# Altium schematic sheet Power.SchDoc
size A4; SheetNumber: 4; SheetTotal: 4
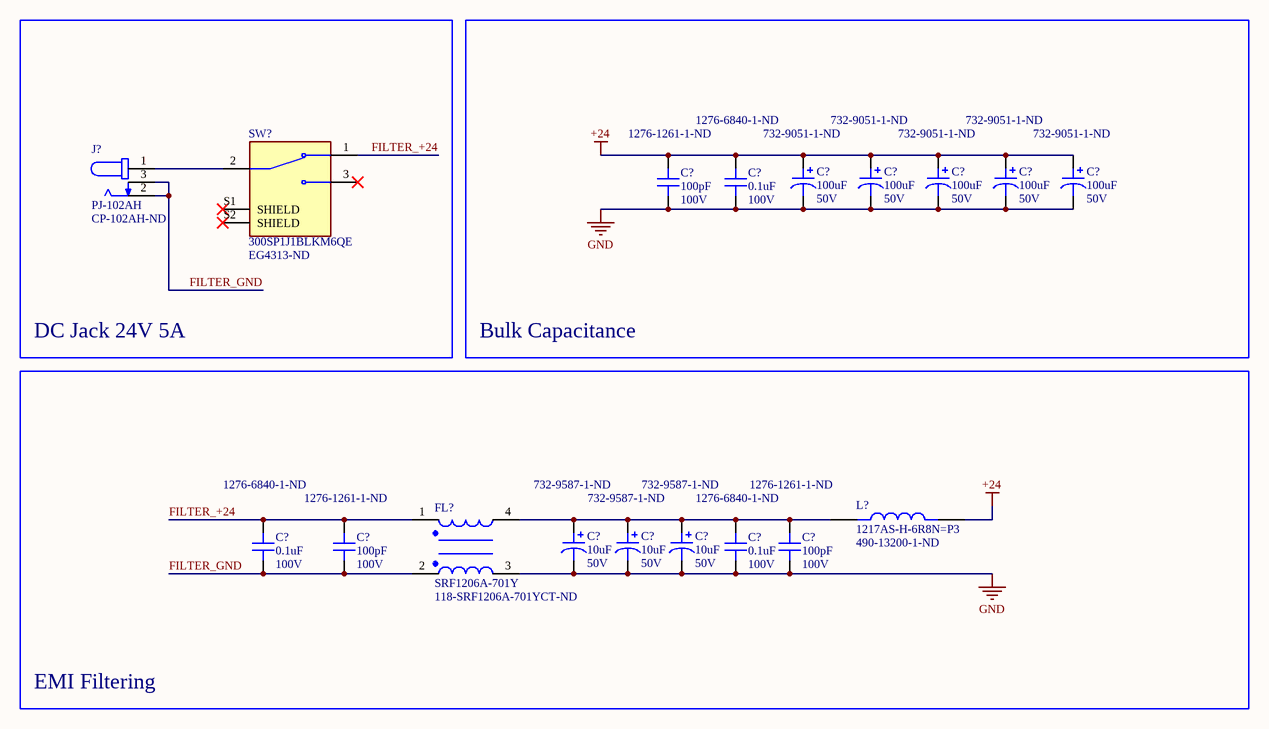
[diagram p0: Power.SchDoc]

## Parts
(Parts that share a designator on the sheet are numbered #1, #2 ... from top to bottom, then left to right.)
C?#1  value 100pF  Voltage: 100V  Supplier Part Number 1: 1276-1261-1-ND  [CAP 0402/1005]  (hidden comment: Capacitor_SMD)
C?#2  value 0.1uF  Voltage: 100V  Supplier Part Number 1: 1276-6840-1-ND  [CAP 0805/2012]  (hidden comment: Capacitor_SMD)
C?#3  value 100uF  Voltage: 50V  Supplier Part Number 1: 732-9051-1-ND  [CAP AL TH D8 L3.5 H21]  (hidden comment: Capacitor_Pol)
C?#4  value 100uF  Voltage: 50V  Supplier Part Number 1: 732-9051-1-ND  [CAP AL TH D8 L3.5 H21]  (hidden comment: Capacitor_Pol)
C?#5  value 100uF  Voltage: 50V  Supplier Part Number 1: 732-9051-1-ND  [CAP AL TH D8 L3.5 H21]  (hidden comment: Capacitor_Pol)
C?#6  value 100uF  Voltage: 50V  Supplier Part Number 1: 732-9051-1-ND  [CAP AL TH D8 L3.5 H21]  (hidden comment: Capacitor_Pol)
C?#7  value 100uF  Voltage: 50V  Supplier Part Number 1: 732-9051-1-ND  [CAP AL TH D8 L3.5 H21]  (hidden comment: Capacitor_Pol)
C?#8  value 0.1uF  Voltage: 100V  Supplier Part Number 1: 1276-6840-1-ND  [CAP 0805/2012]  (hidden comment: Capacitor_SMD)
C?#9  value 100pF  Voltage: 100V  Supplier Part Number 1: 1276-1261-1-ND  [CAP 0402/1005]  (hidden comment: Capacitor_SMD)
C?#10  value 10uF  Voltage: 50V  Supplier Part Number 1: 732-9587-1-ND  [CAP AL TH D5 L2 H12.5]  (hidden comment: Capacitor_Pol)
C?#11  value 10uF  Voltage: 50V  Supplier Part Number 1: 732-9587-1-ND  [CAP AL TH D5 L2 H12.5]  (hidden comment: Capacitor_Pol)
C?#12  value 10uF  Voltage: 50V  Supplier Part Number 1: 732-9587-1-ND  [CAP AL TH D5 L2 H12.5]  (hidden comment: Capacitor_Pol)
C?#13  value 0.1uF  Voltage: 100V  Supplier Part Number 1: 1276-6840-1-ND  [CAP 0805/2012]  (hidden comment: Capacitor_SMD)
C?#14  value 100pF  Voltage: 100V  Supplier Part Number 1: 1276-1261-1-ND  [CAP 0402/1005]  (hidden comment: Capacitor_SMD)
FL?  SRF1206A-701Y  Supplier Part Number 1: 118-SRF1206A-701YCT-ND
J?  PJ-102AH  Supplier Part Number 1: CP-102AH-ND  [CUI_PJ-102AH]
L?  1217AS-H-6R8N=P3  Supplier Part Number 1: 490-13200-1-ND  [IND_1217AS-H-6R8N=P3]
SW?  300SP1J1BLKM6QE  Supplier Part Number 1: EG4313-ND  [SW_300SP1J1BLKM6QE]

## Blocks framed on the sheet
DC Jack 24V 5A: J? SW?
Bulk Capacitance: C?#1-C?#7
EMI Filtering: C?#8-C?#14 FL? L?

## Nets
+24: C?#1.1 C?#2.1 C?#3.1 C?#4.1 C?#5.1 C?#6.1 C?#7.1 L?.2
GND: C?#1.2 C?#2.2 C?#3.2 C?#4.2 C?#5.2 C?#6.2 C?#7.2 C?#10.2 C?#11.2 C?#12.2 C?#13.2 C?#14.2 FL?.3
FILTER_+24: C?#8.1 C?#9.1 FL?.1 SW?.1
FILTER_GND: C?#8.2 C?#9.2 FL?.2 J?.2 J?.3
NetC?#10_1: C?#10.1 C?#11.1 C?#12.1 C?#13.1 C?#14.1 FL?.4 L?.1
NetJ?_1: J?.1 SW?.2

Not connected (* = marked no-connect by the designer): SW? 3* S1(SHIELD)* S2(SHIELD)*

## Library data of the parts
C?#1 C?#2 C?#8 C?#9 C?#13 C?#14 = Capacitor_SMD: SMD Capacitor; Supplier 1: Digi-Key
C?#3-C?#7 C?#10-C?#12 = Capacitor_Pol: THT Polarised Capacitor; Supplier 1: Digi-Key
FL? = SRF1206A-701Y: Common Mode Choke 80VDC 8A; Value: 9uH; Supplier 1: Digi-Key
J? = PJ-102AH: 2.0 x 6.5 mm, 5.0 A, Horizontal, Through Hole, Tapered Pins, Dc Power Jack Connector; MF: CUI Devices; Digi-Key_Part_Number: CP-102AH-ND; CUI_purchase_URL: https://www.cuidevices.com/product/interconnect/connectors/dc-power-connectors/jacks/pj-102ah?utm_source=snapeda.com&utm_medium=referral&utm_campaign=snapedaBOM; SnapEDA_Link: https://www.snapeda.com/parts/PJ-102AH/CUI%20Devices/view-part/228264/?ref=snap; Package: None; Value: *; Digi-Key_Purchase_URL: https://www.digikey.com/product-detail/en/cui-devices/PJ-102AH/CP-102AH-ND/408448?utm_source=snapeda&utm_medium=aggregator&utm_campaign=symbol; MP: PJ-102AH; Supplier 1: Digi-Key
L? = 1217AS-H-6R8N=P3: Inductor with Inductance: 6.8uH Tol. +/-30%, Package: 3131 (8080); MF: Murata; SnapEDA_Link: https://www.snapeda.com/parts/1217AS-H-6R8N=P3/Murata/view-part/?ref=snap; Digi-Key_Part_Number: 490-14059-2-ND; Purchase-URL: https://pricing.snapeda.com/search/part/1217AS-H-6R8N=P3/?ref=eda; Check_prices: https://www.snapeda.com/parts/1217AS-H-6R8N=P3/Murata/view-part/?ref=eda; Value: 6.8uH; Package: NONSTANDARD; MP: 1217AS-H-6R8N=P3; Supplier 1: Digi-Key
SW? = 300SP1J1BLKM6QE: Rocker Switch SPDT 5A (AC/DC) 120V Through Hole, Right Angle; MF: E-Switch; Value: *; Availability: Unavailable; Price: None; MP: 300SP1J1BLKM6QE; Package: None; SnapEDA_Link: https://www.snapeda.com/parts/300SP1J1BLKM6QE/E-Switch/view-part/585580/?ref=snap; Mouser-Purchase-URL: https://snapeda.com/shop?store=Mouser&id=585580; Supplier 1: Digi-Key